# Altium schematic sheet EST_MainV20_Power.SchDoc
size A4
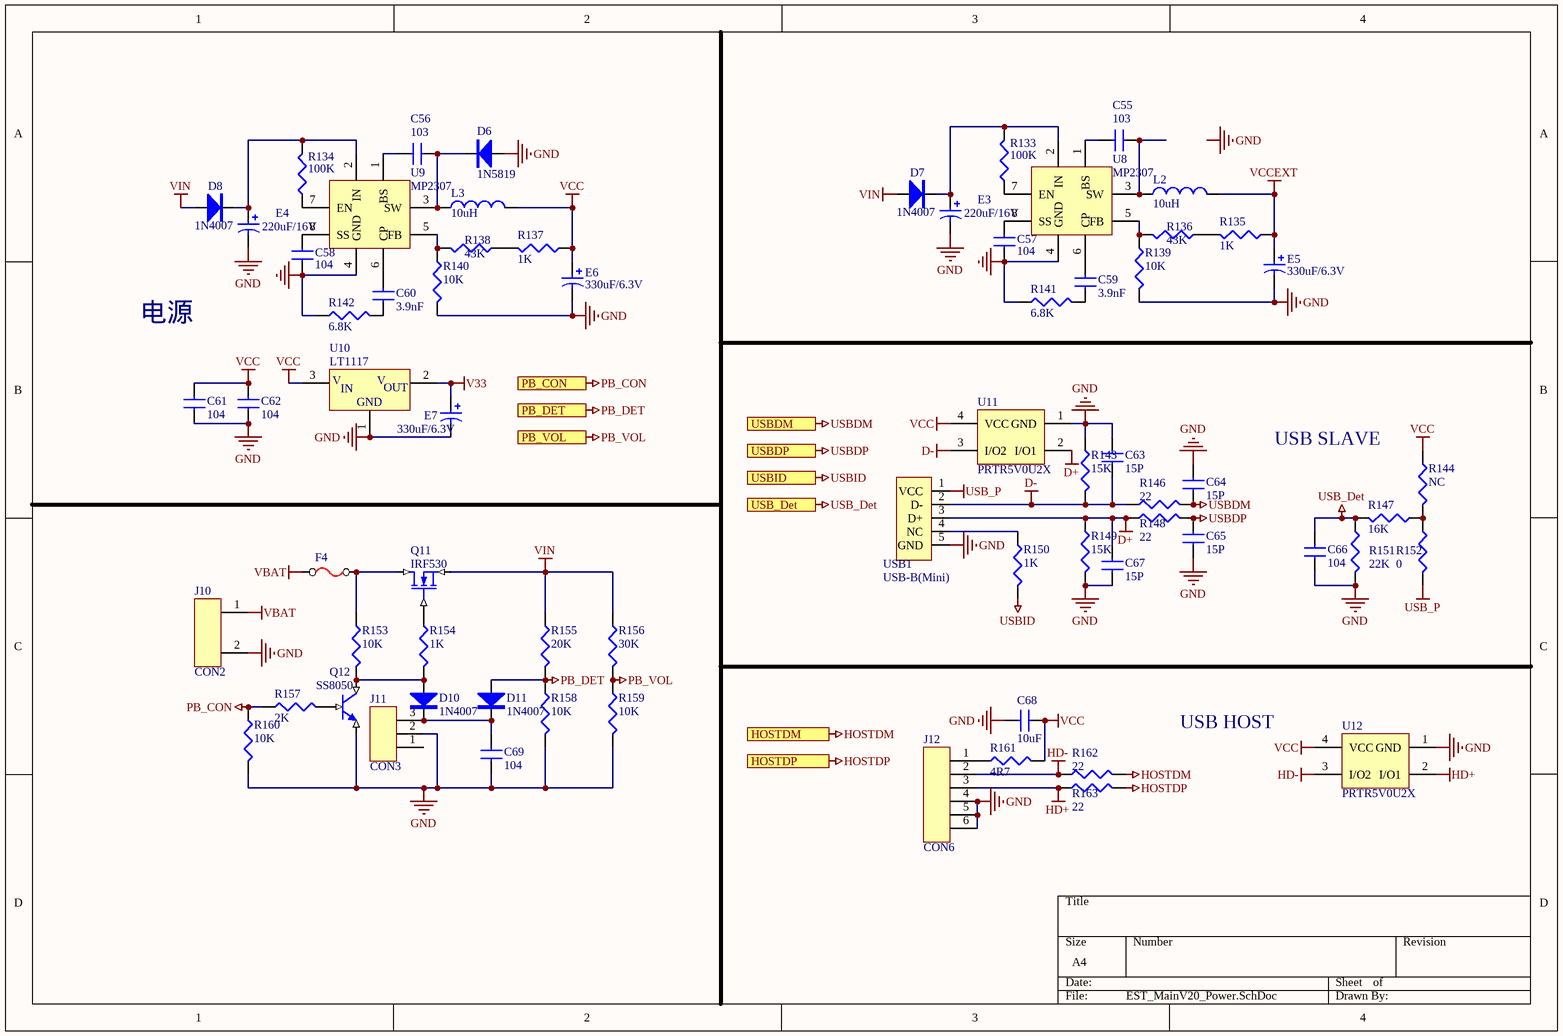
[diagram p0: EST_MainV20_Power.SchDoc]

## Parts
C55  103  [CAP_0603]
C56  103  [CAP_0603]
C57  104  [CAP_0603]
C58  value 104  [CAP_0603]  (hidden comment: 471)
C59  3.9nF  [CAP_0603]
C60  3.9nF  [CAP_0603]
C61  104  [CAP_0603]
C62  104  [CAP_0603]
C63  15P  [CAP_0603]
C64  15P  [CAP_0603]
C65  15P  [CAP_0603]
C66  104  [CAP_0603]
C67  15P  [CAP_0603]
C68  10uF  [CAP_0603]
C69  104  [CAP_0603]
D6  1N5819  [1N4007SMD]
D7  1N4007  [1N4007SMD]
D8  1N4007  [1N4007SMD]
D10  1N4007  [LED-0805]
D11  1N4007  [LED-0805]
E3  value 220uF/16V  [KLF_CD0.254]  (hidden comment: 220uF)
E4  value 220uF/16V  [KLF_CD0.254]  (hidden comment: 220uF)
E5  value 330uF/6.3V  [1812]  (hidden comment: 220uF)
E6  value 330uF/6.3V  [1812]  (hidden comment: 220uF)
E7  value 330uF/6.3V  [1812]  (hidden comment: 220uF)
F4  FUSE  [1812]  (value not drawn)
J10  CON2  [SIP2CON]
J11  CON3  [EST_POW_SW]
J12  CON6  [USB-A]
L2  value 10uH  [L_7x7]  (hidden comment: 220uH)
L3  10uH  [L_7x7]
Q11  IRF530  [8050SMD]
Q12  SS8050  [8050SMD]
R133  value 100K  [RES_0603]  (hidden comment: 0.33)
R134  value 100K  [RES_0603]  (hidden comment: 0.33)
R135  value 1K  [RES_0603]  (hidden comment: 3K)
R136  value 43K  [RES_0603]  (hidden comment: 3K)
R137  value 1K  [RES_0603]  (hidden comment: 3K)
R138  value 43K  [RES_0603]  (hidden comment: 3K)
R139  value 10K  [RES_0603]  (hidden comment: 1K)
R140  value 10K  [RES_0603]  (hidden comment: 1K)
R141  value 6.8K  [RES_0603]  (hidden comment: 1K)
R142  value 6.8K  [RES_0603]  (hidden comment: 1K)
R143  15K  [RES_0603]
R144  NC  [RES_0603]
R146  22  [RES_0603]
R147  16K  [RES_0603]
R148  22  [RES_0603]
R149  15K  [RES_0603]
R150  1K  [RES_0603]
R151  22K  [RES_0603]
R152  0  [RES_0603]
R153  10K  [RES_0603]
R154  1K  [RES_0603]
R155  20K  [RES_0603]
R156  30K  [RES_0603]
R157  2K  [RES_0603]
R158  10K  [RES_0603]
R159  10K  [RES_0603]
R160  10K  [RES_0603]
R161  4R7  [RES_0603]
R162  22  [RES_0603]
R163  22  [RES_0603]
U8  MP2307  [SO-8]
U9  MP2307  [SO-8]
U10  LT1117  [LT1117SMD]
U11  PRTR5V0U2X  [SOT23-4]
U12  PRTR5V0U2X  [SOT23-4]
USB1  USB-B(Mini)  [USB_MINI_5P_DIP]

## Ports
HOSTDM, HOSTDP, PB_CON, PB_DET, PB_VOL, USB_Det, USBDM, USBDP, USBID

## Nets
D+: C67.2 R148.2(BOT) R149.2(BOT) U11.2(I/O1) USB1.3(D+)
D-: C63.1 R143.1(TOP) R146.2(BOT) U11.3(I/O2) USB1.2(D-)
GND: C57.2 C58.2 C61.1 C62.1 C63.2 C64.1 C65.2 C66.1 C67.1 C68.2 C69.1 D6.1(A) E3.2 E4.2 E5.2 E6.2 E7.2 J10.2 J11.2 J12.4 J12.5 J12.6 Q12.1(E) R139.1(TOP) R140.1(TOP) R141.2(BOT) R142.2(BOT) R143.2(BOT) R149.1(TOP) R151.1(TOP) R158.1(TOP) R159.1(TOP) R160.1(TOP) U8.4(GND) U9.4(GND) U10.1(GND) U11.1(GND) U12.1(GND) USB1.5(GND)
HD+: J12.3 R163.2(BOT) U12.2(I/O1)
HD-: J12.2 R162.2(BOT) U12.3(I/O2)
HOSTDM: R162.1(TOP) ; port HOSTDM
HOSTDP: R163.1(TOP) ; port HOSTDP
PB_CON: R157.2(BOT) R160.2(BOT) ; port PB_CON
PB_DET: D11.1(A) R155.1(TOP) R158.2(BOT) ; port PB_DET
PB_VOL: R156.1(TOP) R159.2(BOT) ; port PB_VOL
USB_Det: C66.2 R147.1(TOP) R151.2(BOT) ; port USB_Det
USB_P: R152.1(TOP) USB1.1(VCC)
USBDM: C64.2 R146.1(TOP) ; port USBDM
USBDP: C65.1 R148.1(TOP) ; port USBDP
USBID: R150.1(TOP) ; port USBID
V33: E7.1 U10.2(VOUT)
VBAT: F4.2 J10.1
VCC: C61.2 C62.2 C68.1 E6.1 L3.2 R137.2(BOT) R144.2(BOT) R161.1(TOP) U10.3(VIN) U11.4(VCC) U12.4(VCC)
VCCEXT: E5.1 L2.2 R135.2(BOT)
VIN: D7.1(A) D8.1(A) Q11.3(S) R155.2(BOT) R156.2(BOT)
NetC55_1: C55.1 U8.1(BS)
NetC55_2: C55.2 L2.1 U8.3(SW)
NetC56_1: C56.1 U9.1(BS)
NetC56_2: C56.2 D6.2(K) L3.1 U9.3(SW)
NetC57_1: C57.1 U8.8(SS)
NetC58_1: C58.1 U9.8(SS)
NetC59_1: C59.1 U8.6(CP)
NetC59_2: C59.2 R141.1(TOP)
NetC60_1: C60.1 U9.6(CP)
NetC60_2: C60.2 R142.1(TOP)
NetC69_2: C69.2 D10.2(K) D11.2(K) J11.3
NetD7_2: D7.2(K) E3.1 R133.1(TOP) U8.2(IN)
NetD8_2: D8.2(K) E4.1 R134.1(TOP) U9.2(IN)
NetD10_1: D10.1(A) Q12.3(C) R153.1(TOP) R154.1(TOP)
NetF4_1: F4.1 Q11.1(D) R153.2(BOT)
NetJ12_1: J12.1 R161.2(BOT)
NetQ11_2: Q11.2(G) R154.2(BOT)
NetQ12_2: Q12.2(B) R157.1(TOP)
NetR133_2: R133.2(BOT) U8.7(EN)
NetR134_2: R134.2(BOT) U9.7(EN)
NetR135_1: R135.1(TOP) R136.2(BOT)
NetR136_1: R136.1(TOP) R139.2(BOT) U8.5(FB)
NetR137_1: R137.1(TOP) R138.2(BOT)
NetR138_1: R138.1(TOP) R140.2(BOT) U9.5(FB)
NetR144_1: R144.1(TOP) R147.2(BOT) R152.2(BOT)
NetR150_2: R150.2(BOT) USB1.4(NC)

Not connected (* = marked no-connect by the designer): J11 1

## Notes on the sheet
- 电源
- USB SLAVE
- USB HOST
- Labels drawn without touching a wire or pin: GND
- (in symbol LT1117) V; IN; OUT

## Library data of the parts
C55 C56 C58-C69 = CAP: Capacitor
C57 = CAP: Capacitor; Value: 471
D6-D8 D10 D11 = DIODE
E3-E7 = CAP2: Bi-Polar Capacitor
J10 = CON2: SOCKET
J11 = CON3Mini
L2 L3 = INDUCTOR
Q11 = IRF530: N-Channel MOSFET
Q12 = NPN: triode
R133-R144 R146-R163 = RES: Resistor
USB1 = USB5